# Altium project LEDLightRing.PrjPcb
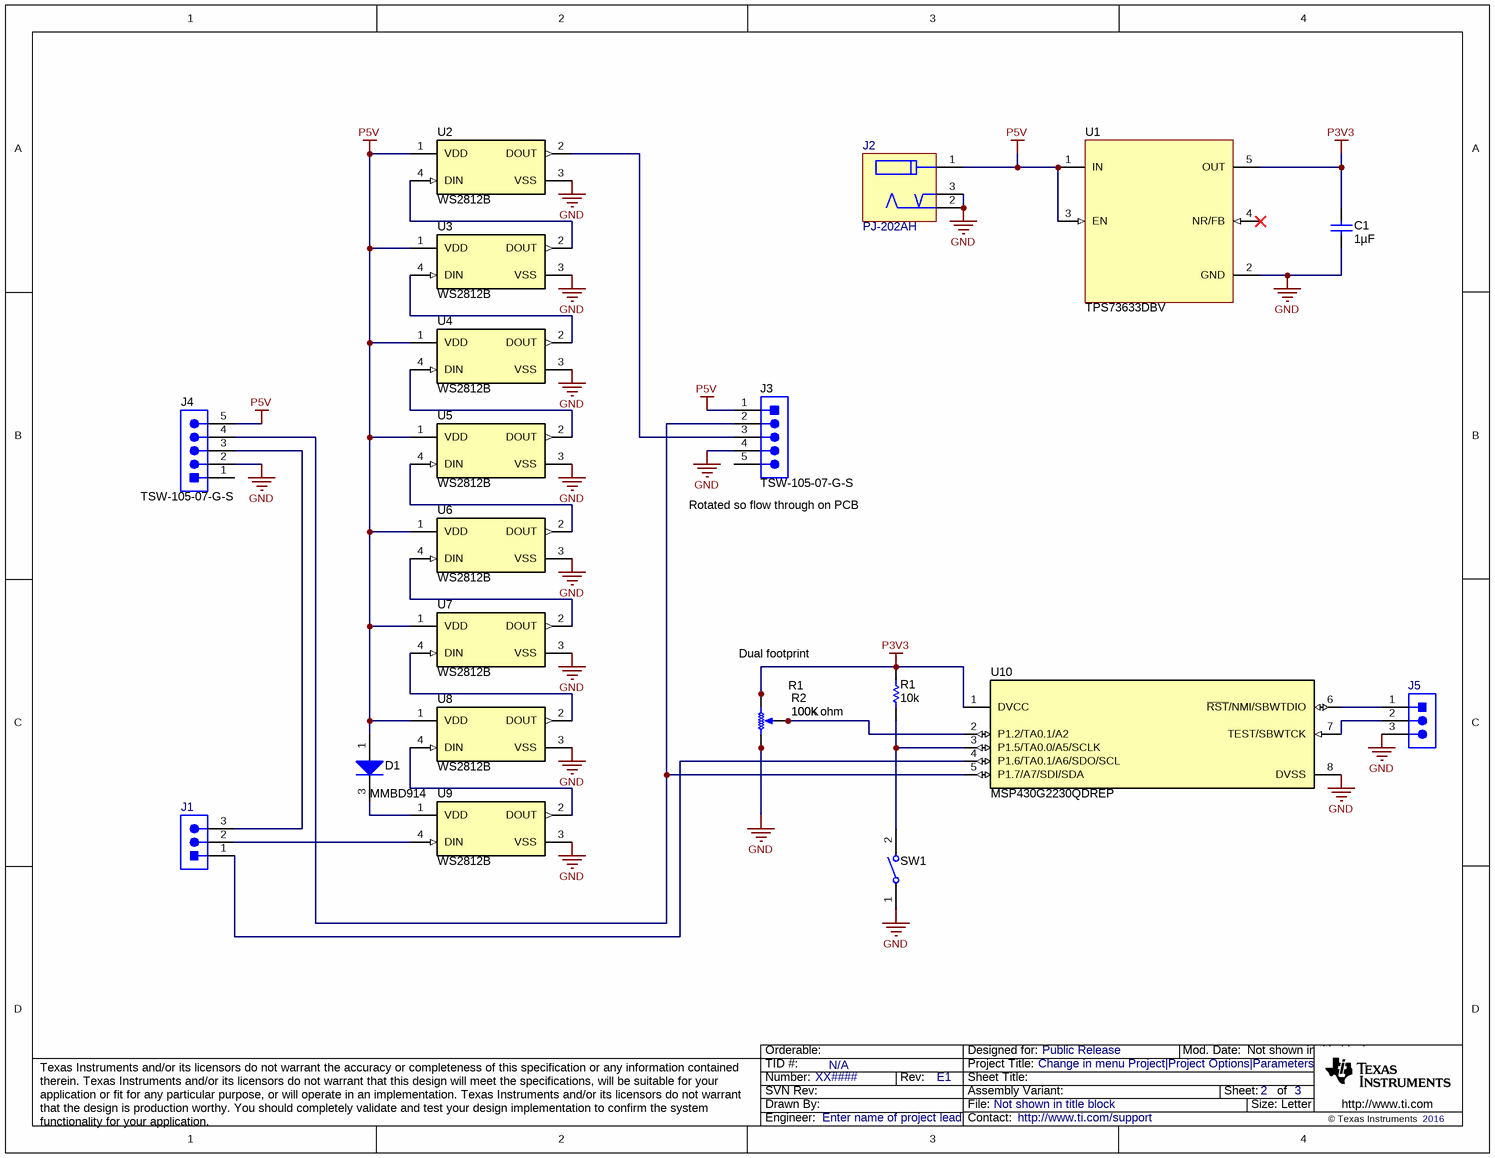
[diagram p0: LEDLightRing.SchDoc]
CopyrightYear: 2016; PCB_Layout: Who did the Layout?; PCB_Rev: E1; PRJ_Customer: Public Release; PRJ_Engineer: Enter name of project lead; PRJ_Number: XX####; PRJ_Title: Change in menu Project|Project Options|Parameters; SCH_Rev: E1; TechSupport: http://www.ti.com/support; TID: N/A
1 sheet, 21 parts. Net scope: global (net labels, ports and power ports of the same name join across sheets).
Board file: LEDLightRing_PCB.PcbDoc

## Sheet LEDLightRing.SchDoc
size Letter; Date: Not shown in title block; ApprovedBy: Not shown in title block; CheckedBy: Not shown in title block; Author: Not shown in title block; CompanyName: Not shown in title block; Engineer: Not shown in title block; Organization: Not shown in title block; Address1: Not shown in title block; Address2: Not shown in title block; Address3: Not shown in title block; Address4: Not shown in title block; DocumentNumber: 1; Revision: Use project parameter SCH_Rev; SheetNumber: 2; SheetTotal: 3; PageSetup: Record=PageOptions|CenterHorizontal=True|CenterVertical=True|PrintScale=1.00|XCorrection=1.00|YCorrection=1.00|PrintKind=0|BorderSize=5000000|LeftOffset=0|BottomOffset=0|Orientation=2|PaperLength=1000|PaperWidth=1000|Scale=100|PaperSource=15|PrintQuality=600|MediaType=1|DitherType=10|PaperKind=Letter|PrintScaleMode=1; CurrentTime: Not shown in title block; CurrentDate: Not shown in title block; Time: Not shown in title block; DocumentFullPathAndName: Not shown in title block; DocumentName: Not shown in title block; ModifiedDate: Not shown in title block; ImagePath: Not shown in title block

### Parts
(Parts that share a designator on the sheet are numbered #1, #2 ... from top to bottom, then left to right.)
C1  ValueDisplayed: 1µF  [0603]  (hidden comment: UMK107AB7105KA-T)
D1  MMBD914  [SOT-23]
J1  TSW-103-07-T-S  [Samtec_TSW-103-07-T-S]  (value not drawn)
J2  PJ-202AH  [CONN_CUI-PJ-202AH]
J3  TSW-105-07-G-S  [TSW-105-07-G-S]
J4  TSW-105-07-G-S  [TSW-105-07-G-S]
J5  TSW-103-07-T-S  [Samtec_TSW-103-07-T-S]  (value not drawn)
R1#1  ValueDisplayed: 10k  [0603]  (hidden comment: CRCW060310K0JNEA)
R1#2  value 100K  [CTS_296UD]  (hidden comment: 296UD104B1N)
R2  value 100k ohm  [Bourns_3386F-T]  (hidden comment: 3386F-1-104TLF)
SW1  RS-032G05A3-SM RT  [SW_RS-032G05A3-SM]  (value not drawn)
U1  TPS73633DBV  [DBV0005A_N]
U2  WS2812B  [WS2812B]
U3  WS2812B  [WS2812B]
U4  WS2812B  [WS2812B]
U5  WS2812B  [WS2812B]
U6  WS2812B  [WS2812B]
U7  WS2812B  [WS2812B]
U8  WS2812B  [WS2812B]
U9  WS2812B  [WS2812B]
U10  MSP430G2230QDREP  [D0008A_M]

### Nets
GND: C1.2 J2.2 J2.3 J3.4 J4.2 J5.3 R1#2.3(CW) R2.1(CCW) SW1.1 U1.2(GND) U2.3(VSS) U3.3(VSS) U4.3(VSS) U5.3(VSS) U6.3(VSS) U7.3(VSS) U8.3(VSS) U9.3(VSS) U10.8(DVSS)
P3V3: C1.1 R1#1.1 R1#2.1(CCW) R2.3(CW) U1.5(OUT) U10.1(DVCC)
P5V: D1.1(A) J2.1 J3.1 J4.5 U1.1(IN) U1.3(EN) U2.1(VDD) U3.1(VDD) U4.1(VDD) U5.1(VDD) U6.1(VDD) U7.1(VDD) U8.1(VDD)
NetD1_3: D1.3(K) U9.1(VDD)
NetJ1_1: J1.1 U10.4(P1.6/TA0.1/A6/SDO/SCL)
NetJ1_2: J1.2 U9.4(DIN)
NetJ1_3: J1.3 J4.3
NetJ3_2: J3.2 J4.4 U10.5(P1.7/A7/SDI/SDA)
NetJ3_3: J3.3 U2.2(DOUT)
NetJ5_1: J5.1 U10.6(~{RST}/NMI/SBWTDIO)
NetJ5_2: J5.2 U10.7(TEST/SBWTCK)
NetR1#1_2: R1#1.2 SW1.2 U10.3(P1.5/TA0.0/A5/SCLK)
NetR1#2_2: R1#2.2(WIPER) R2.2(WIPER) U10.2(P1.2/TA0.1/A2)
NetU2_4: U2.4(DIN) U3.2(DOUT)
NetU3_4: U3.4(DIN) U4.2(DOUT)
NetU4_4: U4.4(DIN) U5.2(DOUT)
NetU5_4: U5.4(DIN) U6.2(DOUT)
NetU6_4: U6.4(DIN) U7.2(DOUT)
NetU7_4: U7.4(DIN) U8.2(DOUT)
NetU8_4: U8.4(DIN) U9.2(DOUT)

Not connected (* = marked no-connect by the designer): J3 5; J4 1; U1 4(NR/FB)*

### Notes on the sheet
- (near J3) Rotated so flow through on PCB
- Dual footprint
- Drawn By:
- SVN Rev:
- Number:
- TID #:
- Orderable:
- Rev:
- Sheet Title:
- File:
- Project Title:
- Designed for:
- Assembly Variant:
- Mod. Date:
- Sheet:
- Size:
- of
- Letter
- http://www.ti.com
- Texas Instruments and/or its licensors do not warrant the accuracy or completeness of this specification or any information contained therein. Texas Instruments and/or its licensors do not warrant that this design will meet the specifications, will be suitable for your application or fit for any particular purpose, or will operate in an implementation. Texas Instruments and/or its licensors do not warrant that the design is production worthy. You should completely validate and test your design implementation to confirm the system functionality for your application.
- Engineer:
- Contact:
- © Texas Instruments

### Library data of the parts
C1 = UMK107AB7105KA-T: CAP, CERM, 1 µF, 50 V, +/- 10%, X7R, 0603; Manufacturer: Taiyo Yuden; Polarized: N; CompType: Capacitor; Value: 1uF; U/M: EA; Cap_F: 0.000001; Tolerance_%: 10; Value1: Unknown; VDC_V: 50; Value2: 50V; TaMin_C: -55; TaMax_C: 125; SymbolVersion: 2008-07-09; PartNumber: UMK107AB7105KA-T; PackageReference: 0603; RoHS: Y; MountType: SMT; Technology: Ceramic; TempCo: X7R; Cap_Case: 0603; Published: 2008-06-19; Publisher: Texas Instruments; LatestRevisionDate: 2015-05-08; ComponentLink1Description: Datasheet link; ComponentLink1URL: http://www.yuden.co.jp/ut/product/category/capacitor/UMK107AB7105KA-T.pdf; Supplier 1: Digi-Key; Supplier Part Number 1: 587-3247-1-ND; Supplier 2: Mouser; Supplier Part Number 2: 963-UMK107AB7105KA-T; Supplier 3: Newark; Supplier Part Number 3: 45W1781
D1 = MMBD914: Diode, P-N, 100 V, 0.2 A, SOT-23; Manufacturer: Fairchild Semiconductor; U/M: EA; Vf_V: 0.95; Value: 100V; Value1: 0.2A; Value2: 0.95V; Io_A: 0.2; Vr_V: 100; TJmax_C: 150; SizeAreaWB_mm2: 14; SizeArea_mm2: 7.5; SizeX_mm: 2.5; SizeY_mm: 3; SizeZ_mm: 1.1; AEC Category: Q101; CompType: Diode; SymbolVersion: 2011-10-13; PartNumber: MMBD914; PackageReference: SOT-23; MountType: SMT; Type: P-N; RoHS: Y; Published: 2008-06-26; Publisher: Texas Instruments; LatestRevisionDate: 2016-11-07; ComponentLink1Description: Datasheet link; ComponentLink1URL: http://www.fairchildsemi.com/ds/MM/MMBD914.pdf; Supplier 1: Digi-Key; Supplier Part Number 1: MMBD914FSCT-ND; Supplier 2: Mouser; Supplier Part Number 2: 512-MMBD914; Supplier 3: Farnell; Supplier Part Number 3: 9844058; AEC Qualified: ?
J1 J5 = TSW-103-07-T-S: Header, 2.54 mm, 3x1, Tin, TH; Manufacturer: Samtec; SymbolCreator: a0799628; Pitch_mm: 2.54; Gender: Male; Shrouded: N; Row_Count: 1; Current_A: 6.3; Voltage_V: 550; Cert_CSA: Y; SymbolVersion: 2013-03-28; PartNumber: TSW-103-07-T-S; PackageReference: Header, 2.54 mm, 3x1, TH; ClassName: Header; CompType: Header; RoHS: Y; MountType: TH; ComponentLink1Description: Datasheet URL; ComponentLink1URL: http://www.samtec.com/ftppub/cpdf/TSW-XXX-XX-XXX-X-XX-XXX-MKT.pdf; Orientation: Vertical; PinCount: 3; ContactFinish: Tin; Color: Black; Cert_UL: Y; Cert_CULUS: N; Cert_VDE: N; Publisher: Texas Instruments; LatestRevisionDate: 2016-02-25; Supplier 1: Digi-Key; Supplier Part Number 1: SAM1035-03-ND
J2 = PJ-202AH: Connector, DC Jack 2.1X5.5 mm, TH; Manufacturer: CUI Inc.; SymbolCreator: a0799628; CompType: Power Jack; SymbolVersion: 2013-07-18; PartNumber: PJ-202AH; PackageReference: Conn, DC Jack, pin  2mm Dia.; RoHS: Y; MountType: TH; ComponentLink1Description: Datasheet URL; ComponentLink1URL: http://www.cui.com/Product/Resource/PJ-202AH.pdf#toolbar=1&navpanes=0&scrollbar=1&view=FitH; Publisher: Texas Instruments; LatestRevisionDate: 2016-02-25; Supplier 1: Digi-Key; Supplier Part Number 1: CP-202AH-ND
J3 J4 = TSW-105-07-G-S: Header, 100mil, 5x1, Gold, TH; Manufacturer: Samtec; SymbolCreator: a0412235; Pitch_mm: 2.54; Gender: Male; Shrouded: N; Row_Count: 1; Current_A: 6.3; Voltage_V: 550; Cert_CSA: Y; SymbolVersion: 2013-12-22; PartNumber: TSW-105-07-G-S; PackageReference: 5x1 Header; ClassName: Header; CompType: Header; RoHS: Y; MountType: TH; ComponentLink1Description: Datasheet URL; ComponentLink1URL: http://samtec.com/ftppub/pdf/TSW_TH.PDF; Orientation: Vertical; PinCount: 5; ContactFinish: Gold; Color: Black; Cert_UL: Y; Cert_CULUS: N; Cert_VDE: N; Publisher: Texas Instruments; LatestRevisionDate: 2016-07-19; Supplier 1: Digi-Key; Supplier Part Number 1: SAM1029-05-ND
R1#1 = CRCW060310K0JNEA: RES, 10 k, 5%, 0.1 W, 0603; Manufacturer: Vishay-Dale; CompType: Resistor; Value: 10k; Res_ohm: 10000; Value_Code: 10k0; Tolerance_%: 5; Power_W: 0.1; Value2: 0.1W; VDC_V: 75; TempCo: 200 ppm/C; EIA_Code: E24; U/M: EA; SymbolVersion: 2009-05-29; PartNumber: CRCW060310K0JNEA; PackageReference: 0603; RoHS: Y; Value1: 5%; MountType: SMT; Technology: Thick Film; Published: 2008-06-26; Publisher: Texas Instruments; LatestRevisionDate: 2015-05-02; ComponentLink1Description: Datasheet link; ComponentLink1URL: http://www.vishay.com/docs/20035/dcrcwe3.pdf; Supplier 1: Digi-Key; Supplier Part Number 1: 541-10KGCT-ND; Supplier 2: Mouser; Supplier Part Number 2: 71-CRCW0603J-10K-E3; Supplier 3: Farnell; Supplier Part Number 3: 1469749
R1#2 = 296UD104B1N: Trimmer, 100k ohms, 0.15 W, TH; Manufacturer: CTS Electrocomponents; Sim Note: Enter the Resistance value and the set point into parameter fields.; SymbolCreator: a0412235; SymbolVersion: 2012-12-27; PartNumber: 296UD104B1N; CompType: Trimmer; MountType: TH; ComponentLink1Description: Datasheet URL; ComponentLink1URL: http://www.ctscorp.com/components/Datasheets/296.pdf; RoHS: Y; PackageReference: TH, 3-Leads, Body 12.5x12.8mm, Height 23.2mm; Publisher: Texas Instruments; LatestRevisionDate: 2017-06-15; Supplier 1: Digi-Key; Supplier Part Number 1: CT2268-ND; Supplier 2: Mouser; Supplier Part Number 2: 774-296UD104B1N
R2 = 3386F-1-103TLF: TRIMMER 100K OHM 0.5W, TH; Manufacturer: Bourns; Sim Note: Enter the Resistance value and the set point into parameter fields.; SymbolCreator: a0412235; Green_Lifecycle: Active; Green_REACh: Passed; SymbolVersion: 2012-12-27; PartNumber: 3386F-1-104TLF; CompType: Trimmer; MountType: TH; ComponentLink1Description: Datasheet URL; ComponentLink1URL: http://www.bourns.com/docs/Product-Datasheets/3386.pdf; RoHS: Y; PackageReference: 9.53x9.53mm; Publisher: Texas Instruments; LatestRevisionDate: 2017-06-15; Supplier 1: Digi-Key; Supplier Part Number 1: 3386F-104TLF-ND; Supplier 2: Newark; Supplier 3: Mouser; Green_EU RoHS: Passed; Green_EU RoHS-2: Incomplete
SW1 = RS-032G05A3-SM RT: Switch, Tactile, SPST-NO, 0.05A, 12V, SMD; Manufacturer: C&K Components; SymbolCreator: a0799628; VDC_V: 12; SwitchFunction: Off-Mom; PositionCount: 1; CurrentRating_mA: 50; SymbolVersion: 2013-06-26; PartNumber: RS-032G05A3-SM RT; MountType: SMT; ComponentLink1Description: Datasheet URL; ComponentLink1URL: http://www.ck-components.com/83942/rs_18dec13.pdf/; RoHS: Y; Circuit: SPST-NO; Orientation: Top Actuated; CompType: Switch; PackageReference: SPST, 6x3.5mm; Publisher: Texas Instruments; LatestRevisionDate: 2015-04-30; Supplier 1: Digi-Key; Supplier Part Number 1: CKN10388CT-ND; Supplier 2: Mouser; Supplier Part Number 2: 611-RS-032G05A3-SMRT
U1 = TPS73633DBV: Cap-Free, NMOS, 400mA Low-Dropout Regulator with Reverse Current Protection, DBV0005A; Manufacturer: Texas Instruments; SymbolCreator: a0411947; CompType: IC; U/M: EA; SymbolVersion: 2013-06-17; PartNumber: TPS73633DBV; PackageReference: DBV0005A; MountType: SMT; ComponentLink1Description: Datasheet Link; ComponentLink1URL: http://www.ti.com/lit/ds/symlink/tps73601.pdf; RoHS: Y; Publisher: Texas Instruments; LatestRevisionDate: 2015-05-04; Alternate Manufacturer: Texas Instruments
U2-U9 = WS2812B: Intelligent Control LED Integrated Light Source; Manufacturer: Hanwei Electronics; SymbolCreator: Altium; SizeAreaWB_mm2: 51.8; SizeArea_mm2: 27; SizeX_mm: 5.4; SizeY_mm: 5; SizeZ_mm: 1.65; SymbolVersion: 2017-03-07; PartNumber: WS2812B; MountType: SMT; ComponentLink1Description: Datasheet URL; ComponentLink1URL: https://www.parallax.com/sites/default/files/downloads/28085-WS2812B-RGB-LED-Datasheet.pdf; RoHS: Y; PackageReference: 5x5mm; Publisher: Texas Instruments; LatestRevisionDate: 2017-06-19; Supplier 1: Newark; Supplier Part Number 1: 43Y4720
U10 = MSP430G2230QDREP: Enhanced Product 16-bit Ultra-Low-Power Mixed Signal Microcontroller, 2kB Flash, 128B RAM, D0008A (SOIC-8); Alternate PartNumber: MSP430G2230QDEP; Manufacturer: Texas Instruments; SymbolCreator: Altium; SizeArea_mm2: 30.38; SizeAreaWB_mm2: 56.58; SizeX_mm: 4.9; SizeY_mm: 6.2; SizeZ_mm: 1.75; CompType: IC; U/M: EA; SymbolVersion: 2015-06-08; PartNumber: MSP430G2230QDREP; PackageReference: D0008A; PackageDescription: SOIC-8; MountType: SMT; ComponentLink1Description: Datasheet Link; ComponentLink1URL: http://www.ti.com/lit/ds/symlink/msp430g2230-ep.pdf; RoHS: Y; Publisher: Texas Instruments; LatestRevisionDate: 2017-05-22; Alternate Manufacturer: Texas Instruments

## Assembly variants
001: not fitted FID1 FID2 FID3